# Altium schematic sheet 2018_CARTE_SENSORS5.SchDoc
size A4
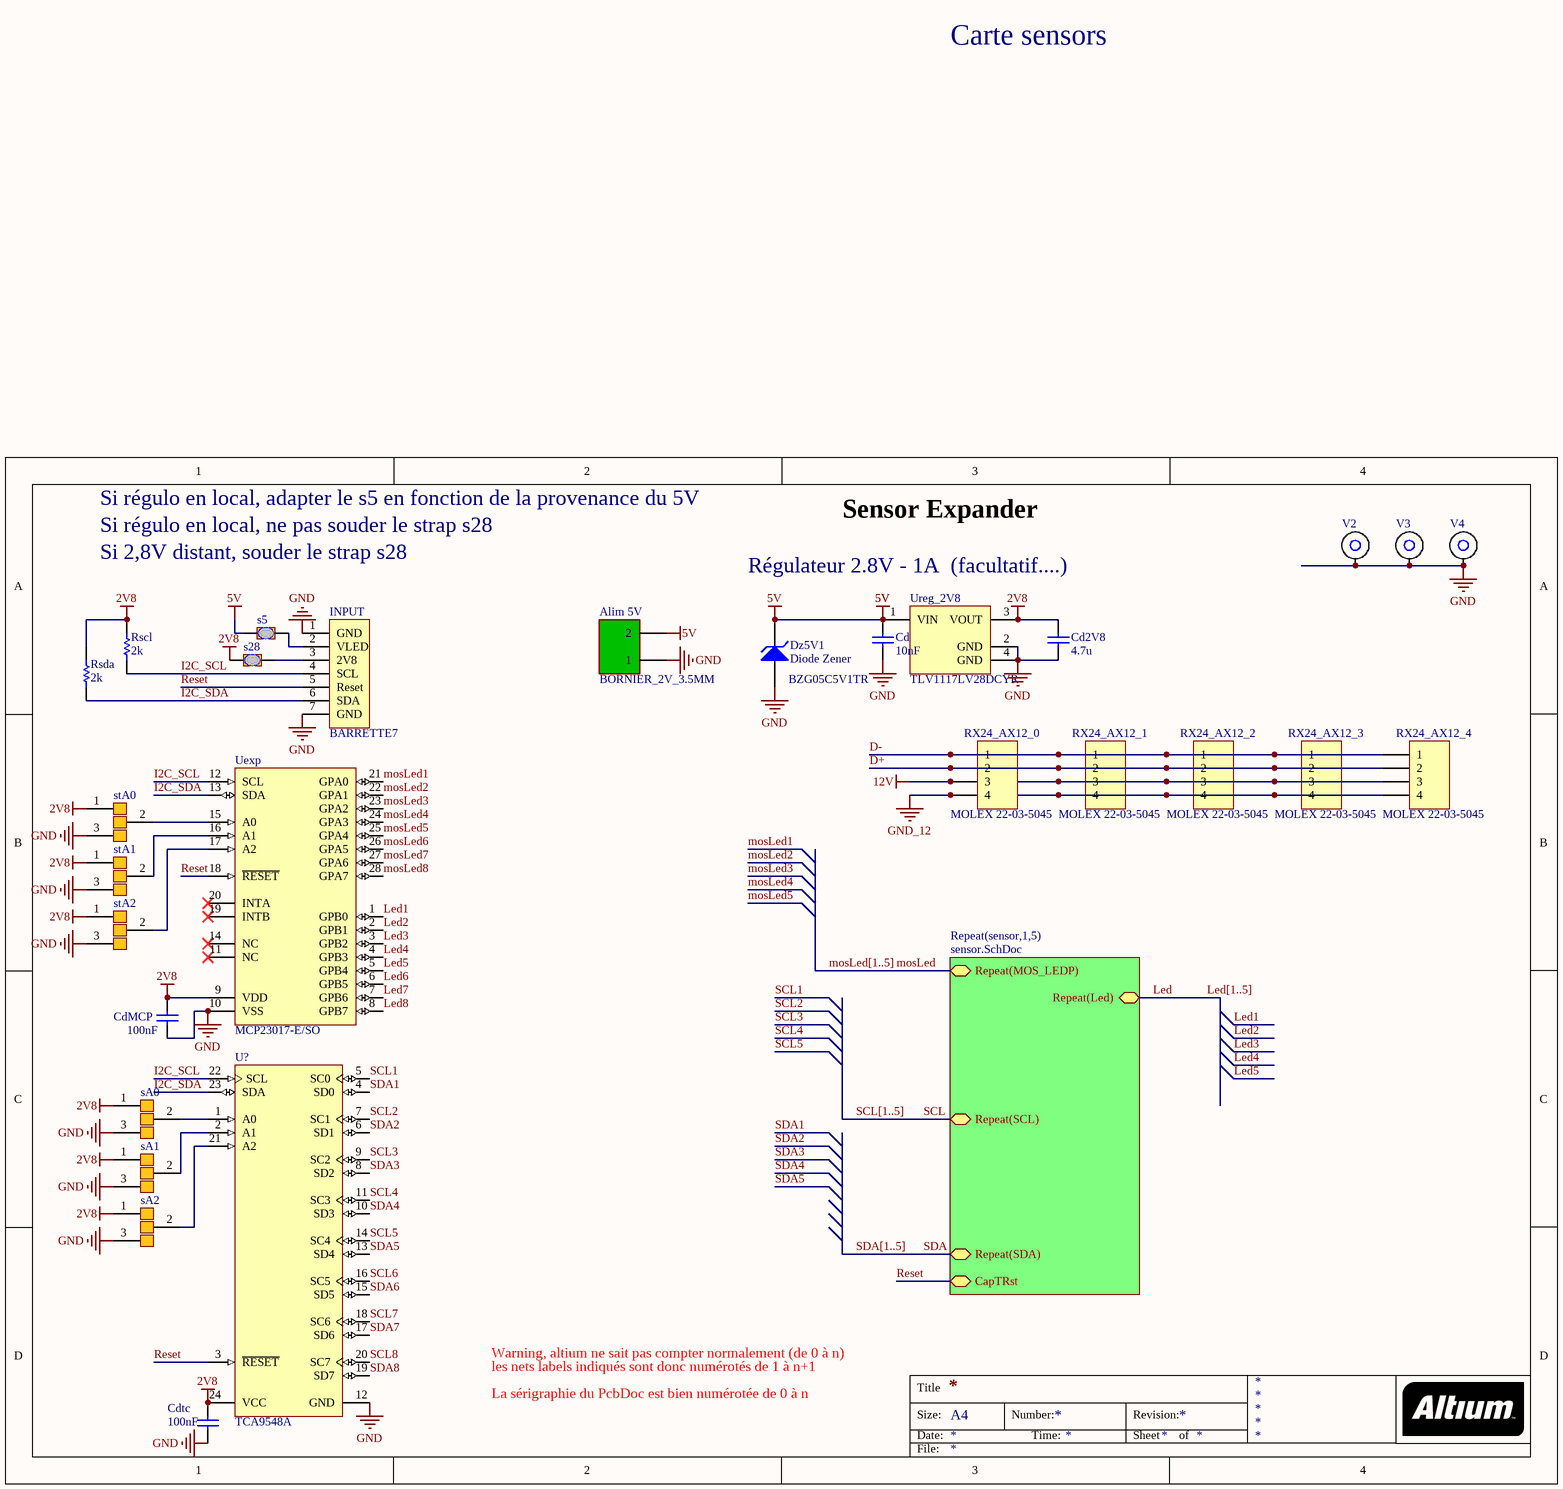
[diagram p0: 2018_CARTE_SENSORS5.SchDoc]

## Parts
Alim_5V  BORNIER_2V_3.5MM  [BORNIER_2V_3.5MM]
Cd  10nF  [C0805_N]
Cd2V8  4.7u  [C1206_N]
CdMCP  100nF  [C0805_N]
Cdtc  100nF  [C0805_N]
Dz5V1  Diode Zener  [SMA Diode]
INPUT  BARRETTE7  [MOLEX7_2.50MM]
Rscl  2k  [R1206_N]
Rsda  2k  [R1206_N]
RX24_AX12_0  MOLEX 22-03-5045  [MOLEX4_2.5MM]
RX24_AX12_1  MOLEX 22-03-5045  [MOLEX4_2.5MM]
RX24_AX12_2  MOLEX 22-03-5045  [MOLEX4_2.5MM]
RX24_AX12_3  MOLEX 22-03-5045  [MOLEX4_2.5MM]
RX24_AX12_4  MOLEX 22-03-5045  [MOLEX4_2.5MM]
s5  Goutte Strap_2  [Goutte Strap_2 Pads_Clearance 0.254mm]  (value not drawn)
s28  Goutte Strap_2  [Goutte Strap_2 Pads_Clearance 0.254mm]  (value not drawn)
sA0  Goutte Strap_3  [Goutte Strap_3 PADS]  (value not drawn)
sA1  Goutte Strap_3  [Goutte Strap_3 PADS]  (value not drawn)
sA2  Goutte Strap_3  [Goutte Strap_3 PADS]  (value not drawn)
stA0  Goutte Strap_3  [Goutte Strap_3 PADS]  (value not drawn)
stA1  Goutte Strap_3  [Goutte Strap_3 PADS]  (value not drawn)
stA2  Goutte Strap_3  [Goutte Strap_3 PADS]  (value not drawn)
U?  TCA9548A  [DB24_N]
Uexp  MCP23017-E/SO  [SOIC-SO28_N]
Ureg_2V8  TLV1117LV28DCYR  [SOT223-4N]
V2  Entretoise WURTH CMS  [ENTRETOISE_CMS]  (value not drawn)
V3  Entretoise WURTH CMS  [ENTRETOISE_CMS]  (value not drawn)
V4  Entretoise WURTH CMS  [ENTRETOISE_CMS]  (value not drawn)

## Sub-sheets
Repeat(sensor,1,5) = sensor.SchDoc: Repeat(MOS_LEDP), CapTRst, Repeat(Led), Repeat(SCL), Repeat(SDA)

## Nets
2V8: Cd2V8.2 CdMCP.2 Cdtc.2 Rscl.1 Rsda.1 s28.1 sA0.1 sA1.1 sA2.1 stA0.1 stA1.1 stA2.1 U?.24(VCC) Uexp.9(VDD) Ureg_2V8.3(VOUT)
5V: Alim_5V.2 Cd.2 Dz5V1.2(K) s5.1 Ureg_2V8.1(VIN)
12V: RX24_AX12_0.3 RX24_AX12_1.3 RX24_AX12_2.3 RX24_AX12_3.3 RX24_AX12_4.3
GND: Alim_5V.1 Cd.1 Cd2V8.1 CdMCP.1 Cdtc.1 Dz5V1.1(A) INPUT.1(GND) INPUT.7(GND) sA0.3 sA1.3 sA2.3 stA0.3 stA1.3 stA2.3 U?.12(GND) Uexp.10(VSS) Ureg_2V8.2(GND) Ureg_2V8.4(GND) V2.1 V3.1 V4.1
GND_12: RX24_AX12_0.4 RX24_AX12_1.4 RX24_AX12_2.4 RX24_AX12_3.4 RX24_AX12_4.4
D+: RX24_AX12_0.2 RX24_AX12_1.2 RX24_AX12_2.2 RX24_AX12_3.2 RX24_AX12_4.2
D-: RX24_AX12_0.1 RX24_AX12_1.1 RX24_AX12_2.1 RX24_AX12_3.1 RX24_AX12_4.1
I2C_SCL: INPUT.4(SCL) Rscl.2 U?.22(SCL) Uexp.12(SCL)
I2C_SDA: INPUT.6(SDA) Rsda.2 U?.23(SDA) Uexp.13(SDA)
Led: sheet Repeat(sensor,1,5)/Repeat(Led)
Led1: Uexp.1(GPB0)
Led2: Uexp.2(GPB1)
Led3: Uexp.3(GPB2)
Led4: Uexp.4(GPB3)
Led5: Uexp.5(GPB4)
Led6: Uexp.6(GPB5)
Led7: Uexp.7(GPB6)
Led8: Uexp.8(GPB7)
mosLed: sheet Repeat(sensor,1,5)/Repeat(MOS_LEDP)
mosLed1: Uexp.21(GPA0)
mosLed2: Uexp.22(GPA1)
mosLed3: Uexp.23(GPA2)
mosLed4: Uexp.24(GPA3)
mosLed5: Uexp.25(GPA4)
mosLed6: Uexp.26(GPA5)
mosLed7: Uexp.27(GPA6)
mosLed8: Uexp.28(GPA7)
Reset: INPUT.5(Reset) U?.3(~{RESET}) Uexp.18(~{RESET}) ; sheet Repeat(sensor,1,5)/CapTRst
SCL: sheet Repeat(sensor,1,5)/Repeat(SCL)
SCL1: U?.5(SC0)
SCL2: U?.7(SC1)
SCL3: U?.9(SC2)
SCL4: U?.11(SC3)
SCL5: U?.14(SC4)
SCL6: U?.16(SC5)
SCL7: U?.18(SC6)
SCL8: U?.20(SC7)
SDA: sheet Repeat(sensor,1,5)/Repeat(SDA)
SDA1: U?.4(SD0)
SDA2: U?.6(SD1)
SDA3: U?.8(SD2)
SDA4: U?.10(SD3)
SDA5: U?.13(SD4)
SDA6: U?.15(SD5)
SDA7: U?.17(SD6)
SDA8: U?.19(SD7)
NetINPUT_2: INPUT.2(VLED) s5.2
NetINPUT_3: INPUT.3(2V8) s28.2
NetsA0_2: sA0.2 U?.1(A0)
NetsA1_2: sA1.2 U?.2(A1)
NetsA2_2: sA2.2 U?.21(A2)
NetstA0_2: stA0.2 Uexp.15(A0)
NetstA1_2: stA1.2 Uexp.16(A1)
NetstA2_2: stA2.2 Uexp.17(A2)

Not connected (* = marked no-connect by the designer): Uexp 11(NC)* 14(NC)* 19(INTB)* 20(INTA)*

## Buses and harness runs
bus Led[1..5]
bus mosLed[1..5]
bus SCL[1..5]
bus SDA[1..5]

## Notes on the sheet
- Carte sensors
- Si régulo en local, ne pas souder le strap s28
- Si 2,8V distant, souder le strap s28
- Si régulo en local, adapter le s5 en fonction de la provenance du 5V
- Sensor Expander
- Régulateur 2.8V - 1A  (facultatif....)
- Warning, altium ne sait pas compter normalement (de 0 à n)
- les nets labels indiqués sont donc numérotés de 1 à n+1
- La sérigraphie du PcbDoc est bien numérotée de 0 à n
- Title
- Size:
- Date:
- A4
- Number:
- Time:
- Revision:
- Sheet
- of
- File:
- (in symbol Diode Zener) BZG05C5V1TR

## Library data of the parts
Cd CdMCP Cdtc = Condensateur: Capacitor; Published: 8-Jun-2000; LatestRevisionDate: 17-Jul-2002; LatestRevisionNote: Re-released for DXP Platform.; PackageReference: RAD-0.3; Publisher: Altium Limited
Cd2V8 = Capacitor: Published: 8-Jun-2000; LatestRevisionDate: 17-Jul-2002; LatestRevisionNote: Re-released for DXP Platform.; PackageReference: RAD-0.3; Publisher: Altium Limited
Dz5V1 = Diode Zener: Zener Diode
INPUT = BARRETTE7: Header, 6-Pin; LatestRevisionDate: 17-Jul-2002; LatestRevisionNote: Re-released for DXP Platform.; Publisher: Altium Limited
Rscl Rsda = Resistor: Published: 8-Jun-2000; LatestRevisionDate: 17-Jul-2002; LatestRevisionNote: Re-released for DXP Platform.; PackageReference: AXIAL-0.5; Publisher: Altium Limited
RX24_AX12_0-RX24_AX12_4 = BARRETTE4: Header, 4-Pin; LatestRevisionDate: 17-Jul-2002; LatestRevisionNote: Re-released for DXP Platform.; Publisher: Altium Limited
U? = PCA9548ADB: 8-Channel I2C Switch with Reset, 2.3 to 5.5 V, -40 to 85 degC, 24-pin SSOP (DB), Green (RoHS & no Sb/Br); Manufacturer: Texas Instruments; SubFamily: I2C Multiplexer, Switch; Technology Family: PCA; fSCLK(Max)(MHz): 100, 400; VCC(Min)(V): 2.3; VCC(Max)(V): 5.5; Max Frequency(kHz): 400; I2C Address: 1110 xxx; Channel Width: 8; Reset Input: Yes; Simultaneously Active Channels: 1 to 8; DatasheetVersion: SCPS143C; PackageVersion: revE, Dec-2001; PackageReference: DB24; PackageDescription: 24-Pin Plastic Small Outline Package, 8.2 x 5.3 mm Body, 0.65 mm Pitch; Supplier 1: Digi-Key; Supplier Part Number 1: PCA9548ADB-ND; Supplier 2: Farnell; Supplier Part Number 2: 1574999; Supplier 3: Newark; Supplier Part Number 3: 22M1598; Supplier 4: Mouser; Supplier Part Number 4: 595-PCA9548ADB; Eco-Plan: Green (RoHS & no Sb/Br); Vcc range(V): 2.3 to 5.5; 5V Tolerant I/O: Yes; Open Drain I/O Type: Yes; Mounting Technology: Surface Mount; PartNumber: PCA9548ADB; Code_JEDEC: MO-150; ComponentLink1Description: Datasheet; ComponentLink1URL: http://www.ti.com/general/docs/lit/getliterature.tsp?genericPartNumber=PCA9548A&fileType=pdf; ComponentLink2Description: Package Specification; ComponentLink2URL: http://www.ti.com/litv/pdf/mpds211a
Uexp = MCP23017-E/SO: 16-Bit I/O Expander with Serial Interface, 28-Pin SOIC, Extended Temperature; Manufacturer: Microchip; DatasheetVersion: revB, Feb-2007; PackageVersion: revBB, Aug-2009; PackageReference: SOIC-SO28; PackageDescription: 28-Lead Plastic Small Outline (SO) - Wide 7.50mm Body [SOIC]; Supplier 1: Digi-Key; Supplier Part Number 1: MCP23017-E/SO-ND; Supplier 2: Farnell; Supplier Part Number 2: 1332087; Supplier 3: Newark; Supplier Part Number 3: 31K2958; Supplier 4: Newark; Supplier Part Number 4: 34M7442; Supplier 5: Mouser; Supplier Part Number 5: 579-MCP23017-E/SO; Mounting Technology: Surface Mount; Code_JEDEC: MS-013; PartNumber: MCP23017-E/SO; ComponentLink1Description: Manufacturer URL; ComponentLink1URL: http://www.microchip.com/; ComponentLink2Description: Datasheet; ComponentLink2URL: http://ww1.microchip.com/downloads/en/DeviceDoc/21952b.pdf; ComponentLink3Description: Package Specification; ComponentLink3URL: http://www.microchip.com/stellent/groups/techpub_sg/documents/packagingspec/en012702.pdf
Ureg_2V8 = MCP1826S-3302E/DB: 1000 mA, Low Voltage, Low Quiescent Current LDO Regulator, 3-Pin SOT-223, Extended Temperature; FirstPublished: 29-Jan-2009; DatasheetVersion: revA, Aug-2007; PackageVersion: revBB, Aug-2009; PackageReference: SOT-223-DB3; Publisher: Altium Limited; PackageDescription: 3-Lead Plastic Small Outline Transistor (DB) [SOT-223]; Supplier 1: Digi-Key; Supplier Part Number 1: MCP1826S-3302E/DB-ND; Supplier 2: Farnell; Supplier Part Number 2: 1578424; Supplier 3: Newark; Supplier Part Number 3: 27M0037; ComponentLink1Description: Datasheet; ComponentLink1URL: http://ww1.microchip.com/downloads/en/DeviceDoc/22057a.pdf; ComponentLink2Description: Packaging Specification; ComponentLink2URL: http://www.microchip.com/stellent/groups/techpub_sg/documents/packagingspec/en012702.pdf; ComponentLink3Description: Microchip.com Home; ComponentLink3URL: http://www.microchip.com/
V2-V4 = Entretoise WURTH CMS: Entretoise Wurth; Publisher: Damien Guitton
s5 s28 = Goutte Strap_2: LatestRevisionDate: 30/01/11; Publisher: Damien Guitton
sA0-sA2 stA0-stA2 = Goutte Strap_3: LatestRevisionDate: 25/11/09; Publisher: Damien Guitton